# Altium project Top.PrjPCB
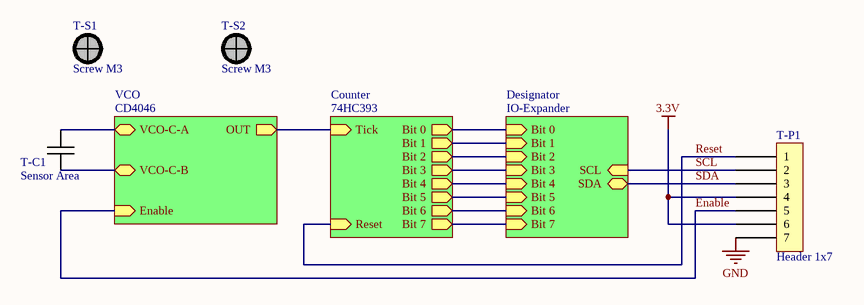
[diagram p0: Top.SchDoc]
4 sheets, 22 parts. Net scope: hierarchical (ports join the sheet entries above them; power ports are global).
Board file: PCB.PcbDoc
Sheets:
  Top.SchDoc
    CD4046 = VCO.SchDoc
    74HC393 = Counter.SchDoc
    Designator = IO-Expander.SchDoc

## Sheet Top.SchDoc
size A4

### Parts
T-C1  Sensor Area
T-P1  Header 1x7  [Header 1x7]
T-S1  Screw M3  [Screw M3]
T-S2  Screw M3  [Screw M3]

### Sub-sheets
74HC393 = Counter: Tick (in), Reset (in), Bit 0 (out), Bit 1 (out), Bit 2 (out), Bit 3 (out), Bit 4 (out), Bit 5 (out), Bit 6 (out), Bit 7 (out)
CD4046 = VCO: VCO-C-A (bidir), VCO-C-B (bidir), OUT (out), Enable (in)
Designator = IO-Expander: Bit 0 (in), Bit 1 (in), Bit 2 (in), Bit 3 (in), Bit 4 (in), Bit 5 (in), Bit 6 (in), Bit 7 (in), SCL (in), SDA (bidir)

### Nets
3.3V: T-P1.4 T-P1.6
GND: T-P1.7
Enable: T-P1.5 ; sheet CD4046/Enable
IO-Bit 0: sheet 74HC393/Bit 0, sheet Designator/Bit 0
IO-Bit 1: sheet 74HC393/Bit 1, sheet Designator/Bit 1
IO-Bit 2: sheet 74HC393/Bit 2, sheet Designator/Bit 2
IO-Bit 3: sheet 74HC393/Bit 3, sheet Designator/Bit 3
IO-Bit 4: sheet 74HC393/Bit 4, sheet Designator/Bit 4
IO-Bit 5: sheet 74HC393/Bit 5, sheet Designator/Bit 5
IO-Bit 6: sheet 74HC393/Bit 6, sheet Designator/Bit 6
IO-Bit 7: sheet 74HC393/Bit 7, sheet Designator/Bit 7
Reset: T-P1.1 ; sheet 74HC393/Reset
SCL: T-P1.2 ; sheet Designator/SCL
SDA: T-P1.3 ; sheet Designator/SDA
VCO-C-A: T-C1.1 ; sheet CD4046/VCO-C-A
VCO-C-B: T-C1.2 ; sheet CD4046/VCO-C-B
NetC-U1_1: sheet CD4046/OUT, sheet 74HC393/Tick

### Library data of the parts
T-C1 = Capacitor

## Sheet VCO.SchDoc
size A4
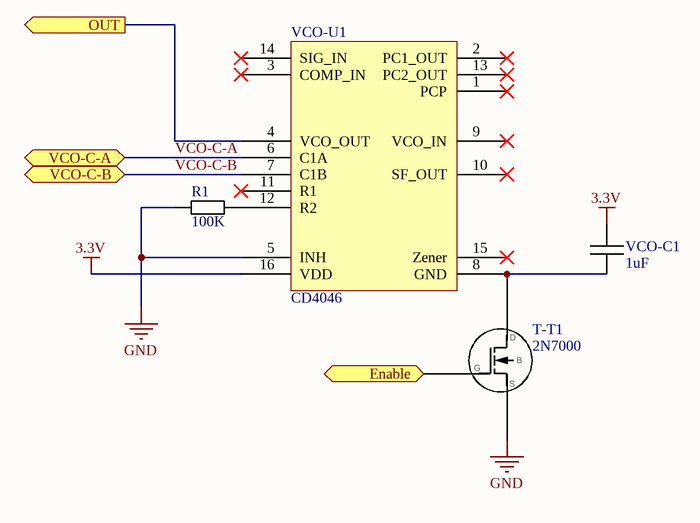
[diagram p1: VCO.SchDoc]

### Parts
R1  100K  [R 0805 / 2012]
T-T1  2N7000  [SOT-23-3]
VCO-C1  1uF  [C 0805 / 2012]
VCO-U1  CD4046  [SOIC-16]

### Ports
Enable (in), OUT (out), VCO-C-A (bidir), VCO-C-B (bidir)

### Nets
3.3V: VCO-C1.1 VCO-U1.16(VDD)
GND: R1.2 T-T1.2 VCO-U1.5(INH)
Enable: T-T1.1 ; port Enable
VCO-C-A: VCO-U1.6(C1A) ; port VCO-C-A
VCO-C-B: VCO-U1.7(C1B) ; port VCO-C-B
NetC-U1_1: VCO-U1.4(VCO_OUT) ; port OUT
NetR1_1: R1.1 VCO-U1.12(R2)
NetT-T1_3: T-T1.3 VCO-C1.2 VCO-U1.8(GND)

Not connected (* = marked no-connect by the designer): VCO-U1 1(PCP)* 2(PC1_OUT)* 3(COMP_IN)* 9(VCO_IN)* 10(SF_OUT)* 11(R1)* 13(PC2_OUT)* 14(SIG_IN)* 15(Zener)*

### Library data of the parts
R1 = Resistor
T-T1 = 2N7000: N-FET
VCO-C1 = Capacitor
VCO-U1 = CD4046: PLL / VCO

## Sheet Counter.SchDoc
size A4
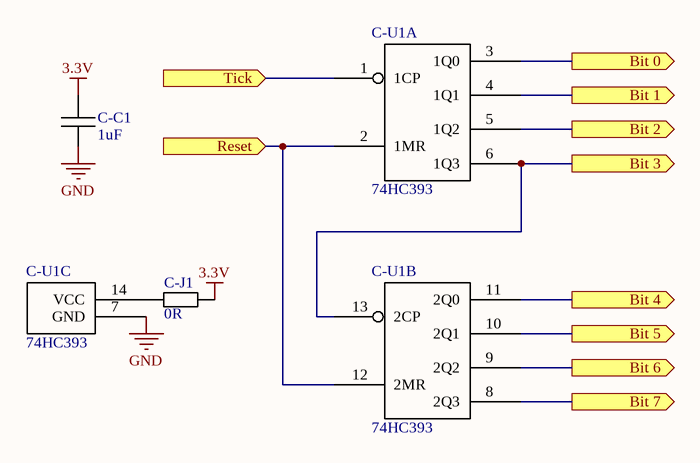
[diagram p2: Counter.SchDoc]

### Parts
C-C1  1uF  [C 0805 / 2012]
C-J1  0R  [R 0805 / 2012 wide]
C-U1  74HC393  [SOIC-14]  (parts A,B,C of 3)

### Ports
Bit 0 (out), Bit 1 (out), Bit 2 (out), Bit 3 (out), Bit 4 (out), Bit 5 (out), Bit 6 (out), Bit 7 (out), Reset (in), Tick (in)

### Nets
3.3V: C-C1.1 C-J1.2
GND: C-C1.2 C-U1.7(GND)
IO-Bit 0: C-U1.3(1Q0) ; port Bit 0
IO-Bit 1: C-U1.4(1Q1) ; port Bit 1
IO-Bit 2: C-U1.5(1Q2) ; port Bit 2
IO-Bit 3: C-U1.6(1Q3) C-U1.13(2CP) ; port Bit 3
IO-Bit 4: C-U1.11(2Q0) ; port Bit 4
IO-Bit 5: C-U1.10(2Q1) ; port Bit 5
IO-Bit 6: C-U1.9(2Q2) ; port Bit 6
IO-Bit 7: C-U1.8(2Q3) ; port Bit 7
Reset: C-U1.2(1MR) C-U1.12(2MR) ; port Reset
NetC-J1_1: C-J1.1 C-U1.14(VCC)
NetC-U1_1: C-U1.1(1CP) ; port Tick

### Library data of the parts
C-C1 = Capacitor
C-J1 = Resistor
C-U1 = 74HC393: Dual 4-Bit Counter

## Sheet IO-Expander.SchDoc
size A4
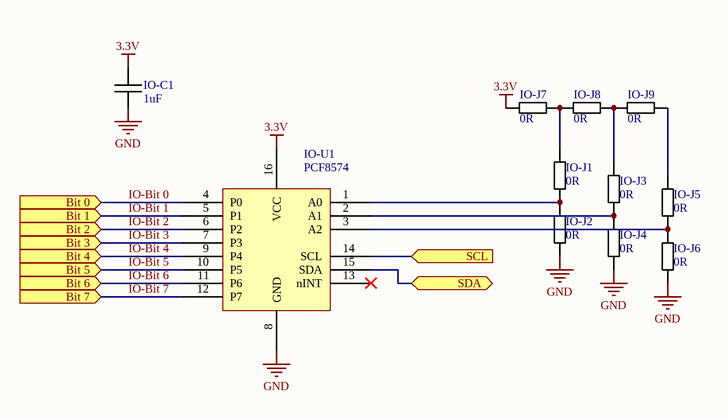
[diagram p3: IO-Expander.SchDoc]

### Parts
IO-C1  1uF  [C 0805 / 2012]
IO-J1  0R  [R 0805 / 2012]
IO-J2  0R  [R 0805 / 2012]
IO-J3  0R  [R 0805 / 2012]
IO-J4  0R  [R 0805 / 2012]
IO-J5  0R  [R 0805 / 2012]
IO-J6  0R  [R 0805 / 2012]
IO-J7  0R  [R 0805 / 2012 wide]
IO-J8  0R  [R 0805 / 2012 wide]
IO-J9  0R  [R 0805 / 2012 wide]
IO-U1  PCF8574  [SOIC-16W]

### Ports
Bit 0 (in), Bit 1 (in), Bit 2 (in), Bit 3 (in), Bit 4 (in), Bit 5 (in), Bit 6 (in), Bit 7 (in), SCL (in), SDA (bidir)

### Nets
3.3V: IO-C1.1 IO-J7.2 IO-U1.16(VCC)
GND: IO-C1.2 IO-J2.1 IO-J4.1 IO-J6.1 IO-U1.8(GND)
IO-Bit 0: IO-U1.4(P0) ; port Bit 0
IO-Bit 1: IO-U1.5(P1) ; port Bit 1
IO-Bit 2: IO-U1.6(P2) ; port Bit 2
IO-Bit 3: IO-U1.7(P3) ; port Bit 3
IO-Bit 4: IO-U1.9(P4) ; port Bit 4
IO-Bit 5: IO-U1.10(P5) ; port Bit 5
IO-Bit 6: IO-U1.11(P6) ; port Bit 6
IO-Bit 7: IO-U1.12(P7) ; port Bit 7
SCL: IO-U1.14(SCL) ; port SCL
SDA: IO-U1.15(SDA) ; port SDA
NetIO-J1_1: IO-J1.1 IO-J2.2 IO-U1.1(A0)
NetIO-J1_2: IO-J1.2 IO-J7.1 IO-J8.2
NetIO-J3_1: IO-J3.1 IO-J4.2 IO-U1.2(A1)
NetIO-J3_2: IO-J3.2 IO-J8.1 IO-J9.2
NetIO-J5_1: IO-J5.1 IO-J6.2 IO-U1.3(A2)
NetIO-J5_2: IO-J5.2 IO-J9.1

Not connected (* = marked no-connect by the designer): IO-U1 13(nINT)*

### Library data of the parts
IO-C1 = Capacitor
IO-J1-IO-J9 = Resistor
IO-U1 = PCF8574: 8-Bit I/O-Expander

## Nets that join several sheets
3.3V: Top (T-P1.4 T-P1.6), VCO (VCO-C1.1 VCO-U1.16), Counter (C-C1.1 C-J1.2), IO-Expander (IO-C1.1 IO-J7.2 IO-U1.16)
GND: Top (T-P1.7), VCO (R1.2 T-T1.2 VCO-U1.5), Counter (C-C1.2 C-U1.7), IO-Expander (5 pins)
Enable: Top (T-P1.5), VCO (T-T1.1)
IO-Bit 0: Counter (C-U1.3), IO-Expander (IO-U1.4)
IO-Bit 1: Counter (C-U1.4), IO-Expander (IO-U1.5)
IO-Bit 2: Counter (C-U1.5), IO-Expander (IO-U1.6)
IO-Bit 3: Counter (C-U1.6 C-U1.13), IO-Expander (IO-U1.7)
IO-Bit 4: Counter (C-U1.11), IO-Expander (IO-U1.9)
IO-Bit 5: Counter (C-U1.10), IO-Expander (IO-U1.10)
IO-Bit 6: Counter (C-U1.9), IO-Expander (IO-U1.11)
IO-Bit 7: Counter (C-U1.8), IO-Expander (IO-U1.12)
NetC-U1_1: VCO (VCO-U1.4), Counter (C-U1.1)
Reset: Top (T-P1.1), Counter (C-U1.2 C-U1.12)
SCL: Top (T-P1.2), IO-Expander (IO-U1.14)
SDA: Top (T-P1.3), IO-Expander (IO-U1.15)
VCO-C-A: Top (T-C1.1), VCO (VCO-U1.6)
VCO-C-B: Top (T-C1.2), VCO (VCO-U1.7)